# Altium schematic sheet COg_TOP.SchDoc
size A4; Author: Audran; CompanyName: Goldorak; Address1: Electrolab; Address2: 52 rue Paul Lescop; Address3: 92000 Nanterre; ProjectName: Cartes_2017
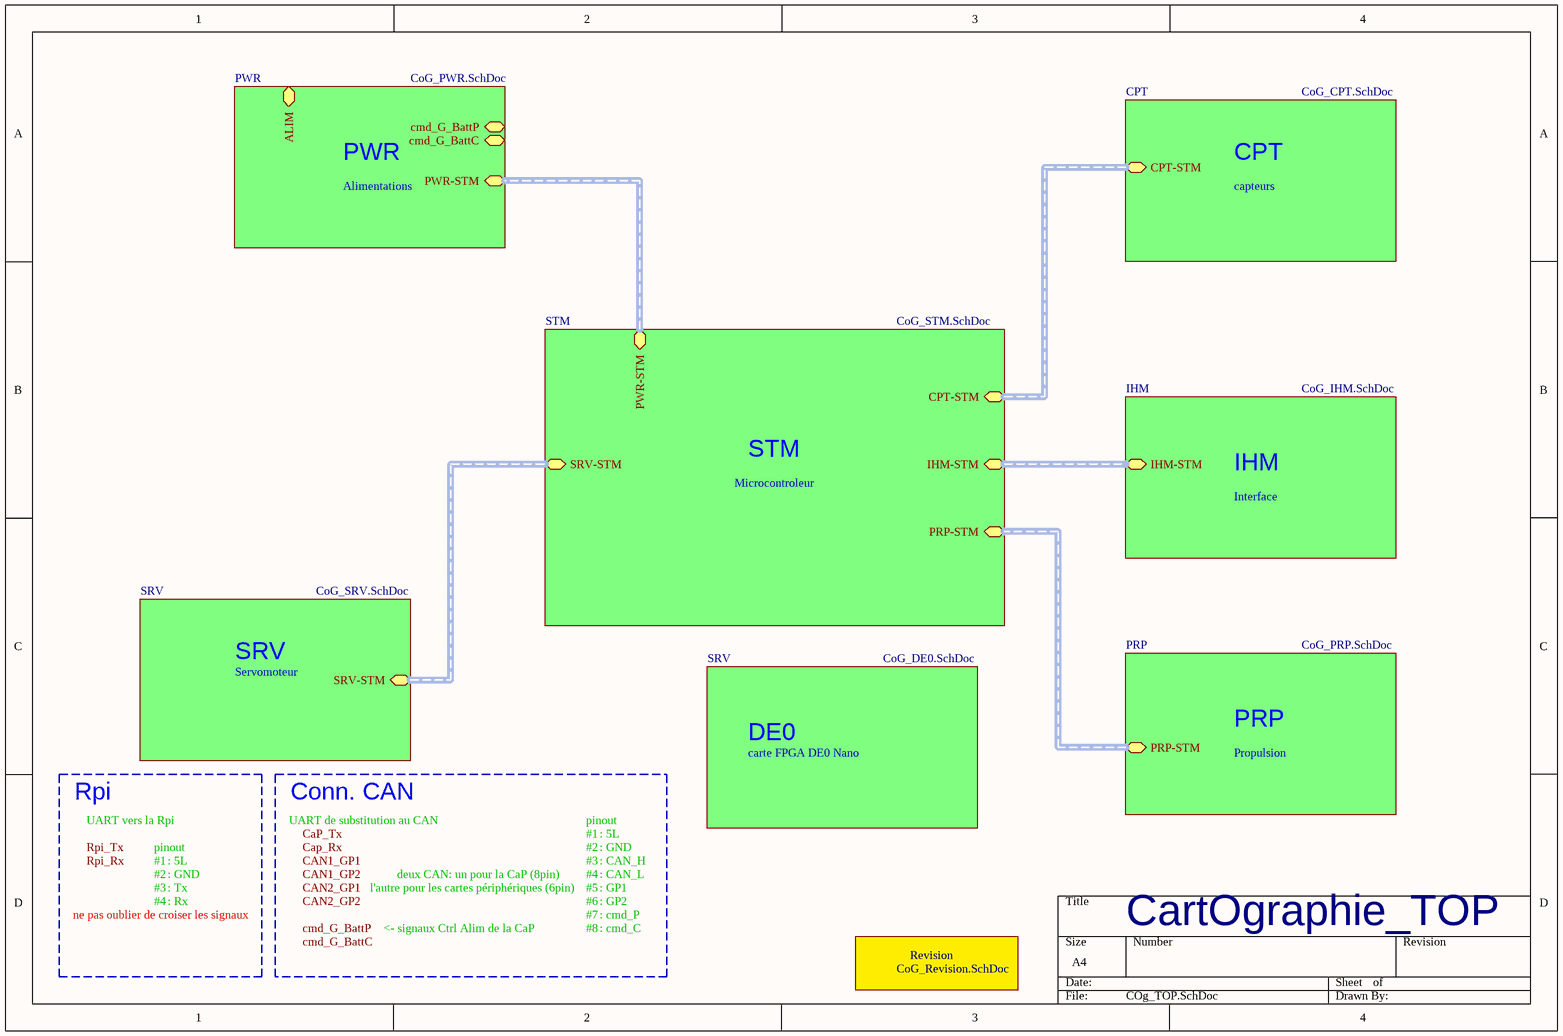
[diagram p0: COg_TOP.SchDoc]

## Sub-sheets
CPT = CoG_CPT.SchDoc: CPT-STM (harness CPT-STM)
IHM = CoG_IHM.SchDoc: IHM-STM (harness IHM-STM)
PRP = CoG_PRP.SchDoc: PRP-STM (harness PRP-STM)
PWR = CoG_PWR.SchDoc: PWR-STM (harness PWR-STM), cmd_G_BattP, cmd_G_BattC, ALIM (harness ALIM)
Revision = CoG_Revision.SchDoc: no entries
SRV = CoG_SRV.SchDoc: SRV-STM (harness SRV-STM)
SRV = CoG_DE0.SchDoc: no entries
STM = CoG_STM.SchDoc: CPT-STM (harness CPT-STM), SRV-STM (harness SRV-STM), PWR-STM (harness PWR-STM), PRP-STM (harness PRP-STM), IHM-STM (harness IHM-STM)

## Buses and harness runs
harness sheet CPT/CPT-STM = sheet STM/CPT-STM
harness sheet IHM/IHM-STM = sheet STM/IHM-STM
harness sheet PRP/PRP-STM = sheet STM/PRP-STM
harness sheet PWR/PWR-STM = sheet STM/PWR-STM
harness sheet SRV/SRV-STM = sheet STM/SRV-STM

## Notes on the sheet
- PWR
- CPT
- Alimentations
- capteurs
- Microcontroleur
- STM
- IHM
- Interface
- SRV
- Servomoteur
- DE0
- carte FPGA DE0 Nano
- PRP
- Propulsion
- Rpi
- UART vers la Rpi
- pinout
- UART de substitution au CAN
- Conn. CAN
- #1
- #2
- : 5L
- : GND
- ne pas oublier de croiser les signaux
- #3
- #4
- : Tx
- : Rx
- l'autre pour les cartes périphériques (6pin)
- deux CAN: un pour la CaP (8pin)
- #5
- #6
- #7
- : CAN_H
- : CAN_L
- : GP1
- : GP2
- : cmd_P
- <- signaux Ctrl Alim de la CaP
- #8
- : cmd_C
- CartOgraphie_TOP
- Labels drawn without touching a wire or pin: CAN1_GP1, CAN1_GP2, CAN2_GP1, CAN2_GP2, Cap_Rx, CaP_Tx, cmd_G_BattC, cmd_G_BattP, Rpi_Rx, Rpi_Tx